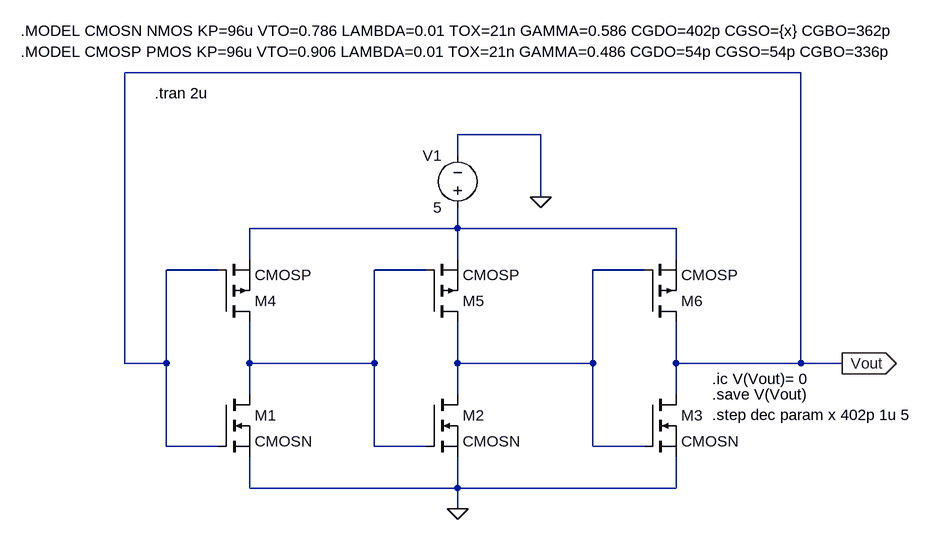
[diagram p0: schematic ringOscillator.asc]
ringOscillator.asc, the LTspice schematic file:
Version 4
SHEET 1 1680 680
WIRE 832 -1440 -208 -1440
WIRE 432 -1344 304 -1344
WIRE 304 -1312 304 -1344
WIRE 432 -1248 432 -1344
WIRE 304 -1200 304 -1232
WIRE 304 -1200 -16 -1200
WIRE 640 -1200 304 -1200
WIRE -16 -1152 -16 -1200
WIRE 304 -1152 304 -1200
WIRE 640 -1152 640 -1200
WIRE -64 -1136 -144 -1136
WIRE 256 -1136 176 -1136
WIRE 592 -1136 512 -1136
WIRE -208 -992 -208 -1440
WIRE -144 -992 -144 -1136
WIRE -144 -992 -208 -992
WIRE -16 -992 -16 -1056
WIRE 176 -992 176 -1136
WIRE 176 -992 -16 -992
WIRE 304 -992 304 -1056
WIRE 512 -992 512 -1136
WIRE 512 -992 304 -992
WIRE 640 -992 640 -1056
WIRE 832 -992 832 -1440
WIRE 832 -992 640 -992
WIRE 896 -992 832 -992
WIRE -16 -944 -16 -992
WIRE 304 -944 304 -992
WIRE 640 -944 640 -992
WIRE -144 -864 -144 -992
WIRE -64 -864 -144 -864
WIRE 176 -864 176 -992
WIRE 256 -864 176 -864
WIRE 512 -864 512 -992
WIRE 592 -864 512 -864
WIRE -16 -800 -16 -848
WIRE 304 -800 304 -848
WIRE 304 -800 -16 -800
WIRE 640 -800 640 -848
WIRE 640 -800 304 -800
WIRE 304 -768 304 -800
FLAG 304 -768 0
FLAG 896 -992 Vout
IOPIN 896 -992 Out
FLAG 432 -1248 0
SYMBOL nmos -64 -944 R0
SYMATTR InstName M1
SYMATTR Value CMOSN
SYMBOL voltage 304 -1216 R180
WINDOW 0 24 96 Left 2
WINDOW 3 24 16 Left 2
WINDOW 123 0 0 Left 0
WINDOW 39 0 0 Left 0
SYMATTR InstName V1
SYMATTR Value 5
SYMBOL nmos 256 -944 R0
SYMATTR InstName M2
SYMATTR Value CMOSN
SYMBOL nmos 592 -944 R0
SYMATTR InstName M3
SYMATTR Value CMOSN
SYMBOL pmos -64 -1056 M180
SYMATTR InstName M4
SYMATTR Value CMOSP
SYMBOL pmos 256 -1056 M180
SYMATTR InstName M5
SYMATTR Value CMOSP
SYMBOL pmos 592 -1056 M180
SYMATTR InstName M6
SYMATTR Value CMOSP
TEXT -368 -1504 Left 2 !.MODEL CMOSN NMOS KP=96u VTO=0.786 LAMBDA=0.01 TOX=21n GAMMA=0.586 CGDO=402p CGSO={x} CGBO=362p
TEXT -368 -1472 Left 2 !.MODEL CMOSP PMOS KP=96u VTO=0.906 LAMBDA=0.01 TOX=21n GAMMA=0.486 CGDO=54p CGSO=54p CGBO=336p
TEXT 696 -968 Left 2 !.ic V(Vout)= 0
TEXT -162 -1408 Left 2 !.tran 2u
TEXT 696 -944 Left 2 !.save V(Vout)\n.step dec param x 402p 1u 5

The netlist it stands for:
* ringOscillator.asc
M1 N002 Vout 0 0 CMOSN
V1 N001 0 5
M2 N003 N002 0 0 CMOSN
M3 Vout N003 0 0 CMOSN
M4 N002 Vout N001 N001 CMOSP
M5 N003 N002 N001 N001 CMOSP
M6 Vout N003 N001 N001 CMOSP
.model NMOS NMOS
.model PMOS PMOS
.lib standard.mos
.MODEL CMOSN NMOS KP=96u VTO=0.786 LAMBDA=0.01 TOX=21n GAMMA=0.586 CGDO=402p CGSO={x} CGBO=362p
.MODEL CMOSP PMOS KP=96u VTO=0.906 LAMBDA=0.01 TOX=21n GAMMA=0.486 CGDO=54p CGSO=54p CGBO=336p
.ic V(Vout)= 0
.tran 2u
.save V(Vout)
.step dec param x 402p 1u 5
.backanno
.end